# Altium schematic sheet Microcontroller.SchDoc: Title
size A4; Date: *******; ApprovedBy: *******; CheckedBy: None; Author: *******; CompanyName: *******; DrawnBy: Name; Engineer: *******; Organization: *******; Address1: *******; Address2: *******; Address3: *******; Address4: *******; DocumentNumber: Doc Num; Revision: *******; SheetNumber: 3; SheetTotal: 4; CurrentTime: *******; CurrentDate: *******; Time: *******; DocumentFullPathAndName: *******; DocumentName: *******; ModifiedDate: *******; ImagePath: *******; ProjectName: *******; Application_BuildNumber: *******
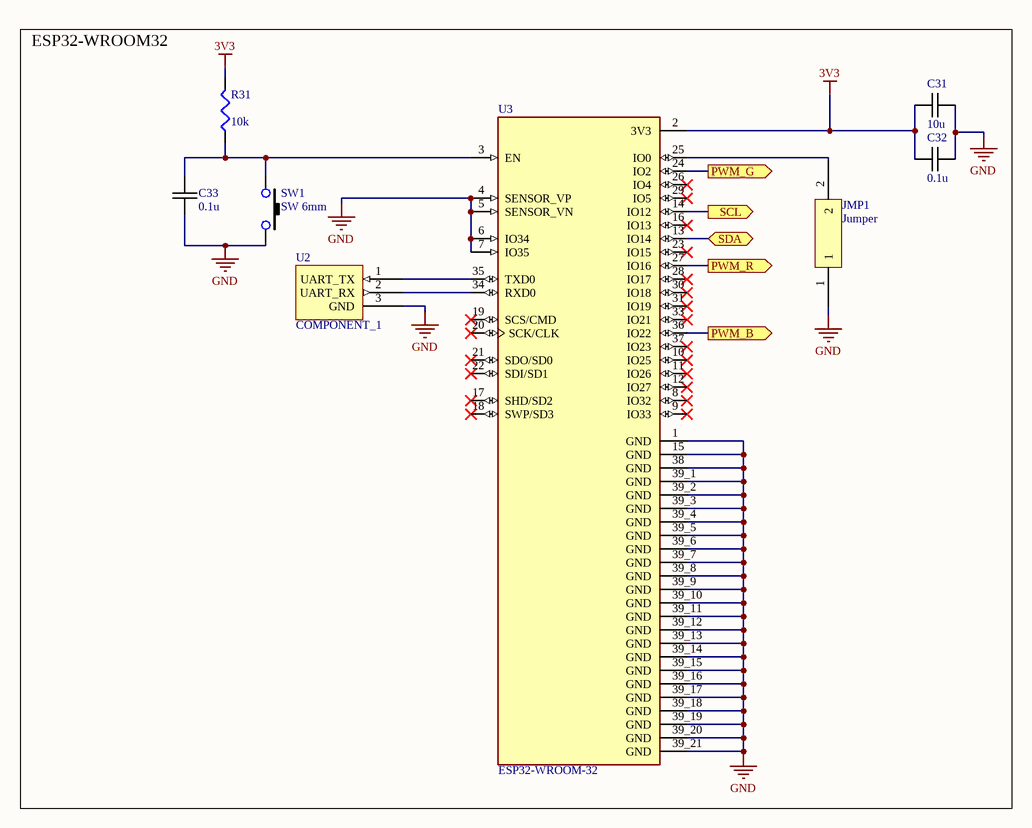
[diagram p0: Microcontroller.SchDoc]

## Parts
C31  10u  [0603C-GENERIC]
C32  0.1u  [0603C-GENERIC]
C33  0.1u  [0603C-GENERIC]
JMP1  Jumper  [jumper]
R31  value 10k  [J1-0603]
SW1  SW 6mm  [SW-PB-SMD]
U2  COMPONENT_1  [PCBComponent_1]
U3  ESP32-WROOM-32  [ESP32]

## Blocks framed on the sheet
ESP32-WROOM32: C31-C33 JMP1 R31 SW1 U2 U3

## Ports
PWM_B (out), PWM_G (out), PWM_R (out), SCL (out), SDA (bidir)

## Nets
3V3: C31.1 C32.1 R31.2 U3.2(3V3)
GND: C31.2 C32.2 C33.2 JMP1.1 SW1.2 U2.3(GND) U3.1(GND) U3.4(SENSOR_VP) U3.5(SENSOR_VN) U3.6(IO34) U3.7(IO35) U3.15(GND) U3.38(GND) U3.39_1(GND) U3.39_2(GND) U3.39_3(GND) U3.39_4(GND) U3.39_5(GND) U3.39_6(GND) U3.39_7(GND) U3.39_8(GND) U3.39_9(GND) U3.39_10(GND) U3.39_11(GND) U3.39_12(GND) U3.39_13(GND) U3.39_14(GND) U3.39_15(GND) U3.39_16(GND) U3.39_17(GND) U3.39_18(GND) U3.39_19(GND) U3.39_20(GND) U3.39_21(GND)
PWM_B: U3.36(IO22) ; port PWM_B
PWM_G: U3.24(IO2) ; port PWM_G
PWM_R: U3.27(IO16) ; port PWM_R
SCL: U3.14(IO12) ; port SCL
SDA: U3.13(IO14) ; port SDA
NetC33_1: C33.1 R31.1 SW1.1 U3.3(EN)
NetJMP1_2: JMP1.2 U3.25(IO0)
NetU2_1: U2.1(UART_TX) U3.35(TXD0)
NetU2_2: U2.2(UART_RX) U3.34(RXD0)

Not connected (* = marked no-connect by the designer): U3 8(IO32)* 9(IO33)* 10(IO25)* 11(IO26)* 12(IO27)* 16(IO13)* 17(SHD/SD2)* 18(SWP/SD3)* 19(SCS/CMD)* 20(SCK/CLK)* 21(SDO/SD0)* 22(SDI/SD1)* 23(IO15)* 26(IO4)* 28(IO17)* 29(IO5)* 30(IO18)* 31(IO19)* 33(IO21)* 37(IO23)*

## Notes on the sheet
- Title:
- Drawn By:
- Page Contents:
- Checked By:
- Size:
- Date:
- File:
- License:
- Email:
- A4
- Number:
- Time:
- Revision:
- Sheet
- Website:
- of

## Library data of the parts
C31-C33 = C0603-GENERIC: GENERIC CAPACITOR NON POLARISED 0603
R31 = Res3: Resistor; Published: 8-Jun-2000; LatestRevisionDate: 29-May-2009; LatestRevisionNote: IPC-7351 Footprint Added.; PackageReference: J1-0603; Publisher: Altium Limited; PackageDescription: Chip Resistor
SW1 = SW-PB6MM-SMD: PUSHBUTTON SWITCH 6MM SMD
U3 = ESP32-WROOM-32: Bluetooth, WiFi Transceiver Module 2.4GHz ~ 2.5GHz Surface Mount; MF: Espressif Systems; Package: Module Espressif Systems; Digi-Key_Part_Number: 1904-1010-1-ND; Digi-Key_Purchase_URL: https://www.digikey.com/product-detail/en/espressif-systems/ESP32-WROOM-32/1904-1010-1-ND/8544305?utm_source=snapeda&utm_medium=aggregator&utm_campaign=symbol; Value: *; MP: ESP32-WROOM-32; SnapEDA_Link: https://www.snapeda.com/parts/ESP32-WROOM-32/Espressif%20Systems/view-part/2753322/?ref=snap